# Altium schematic sheet STM32F103VET6_Board.SchDoc
size A1
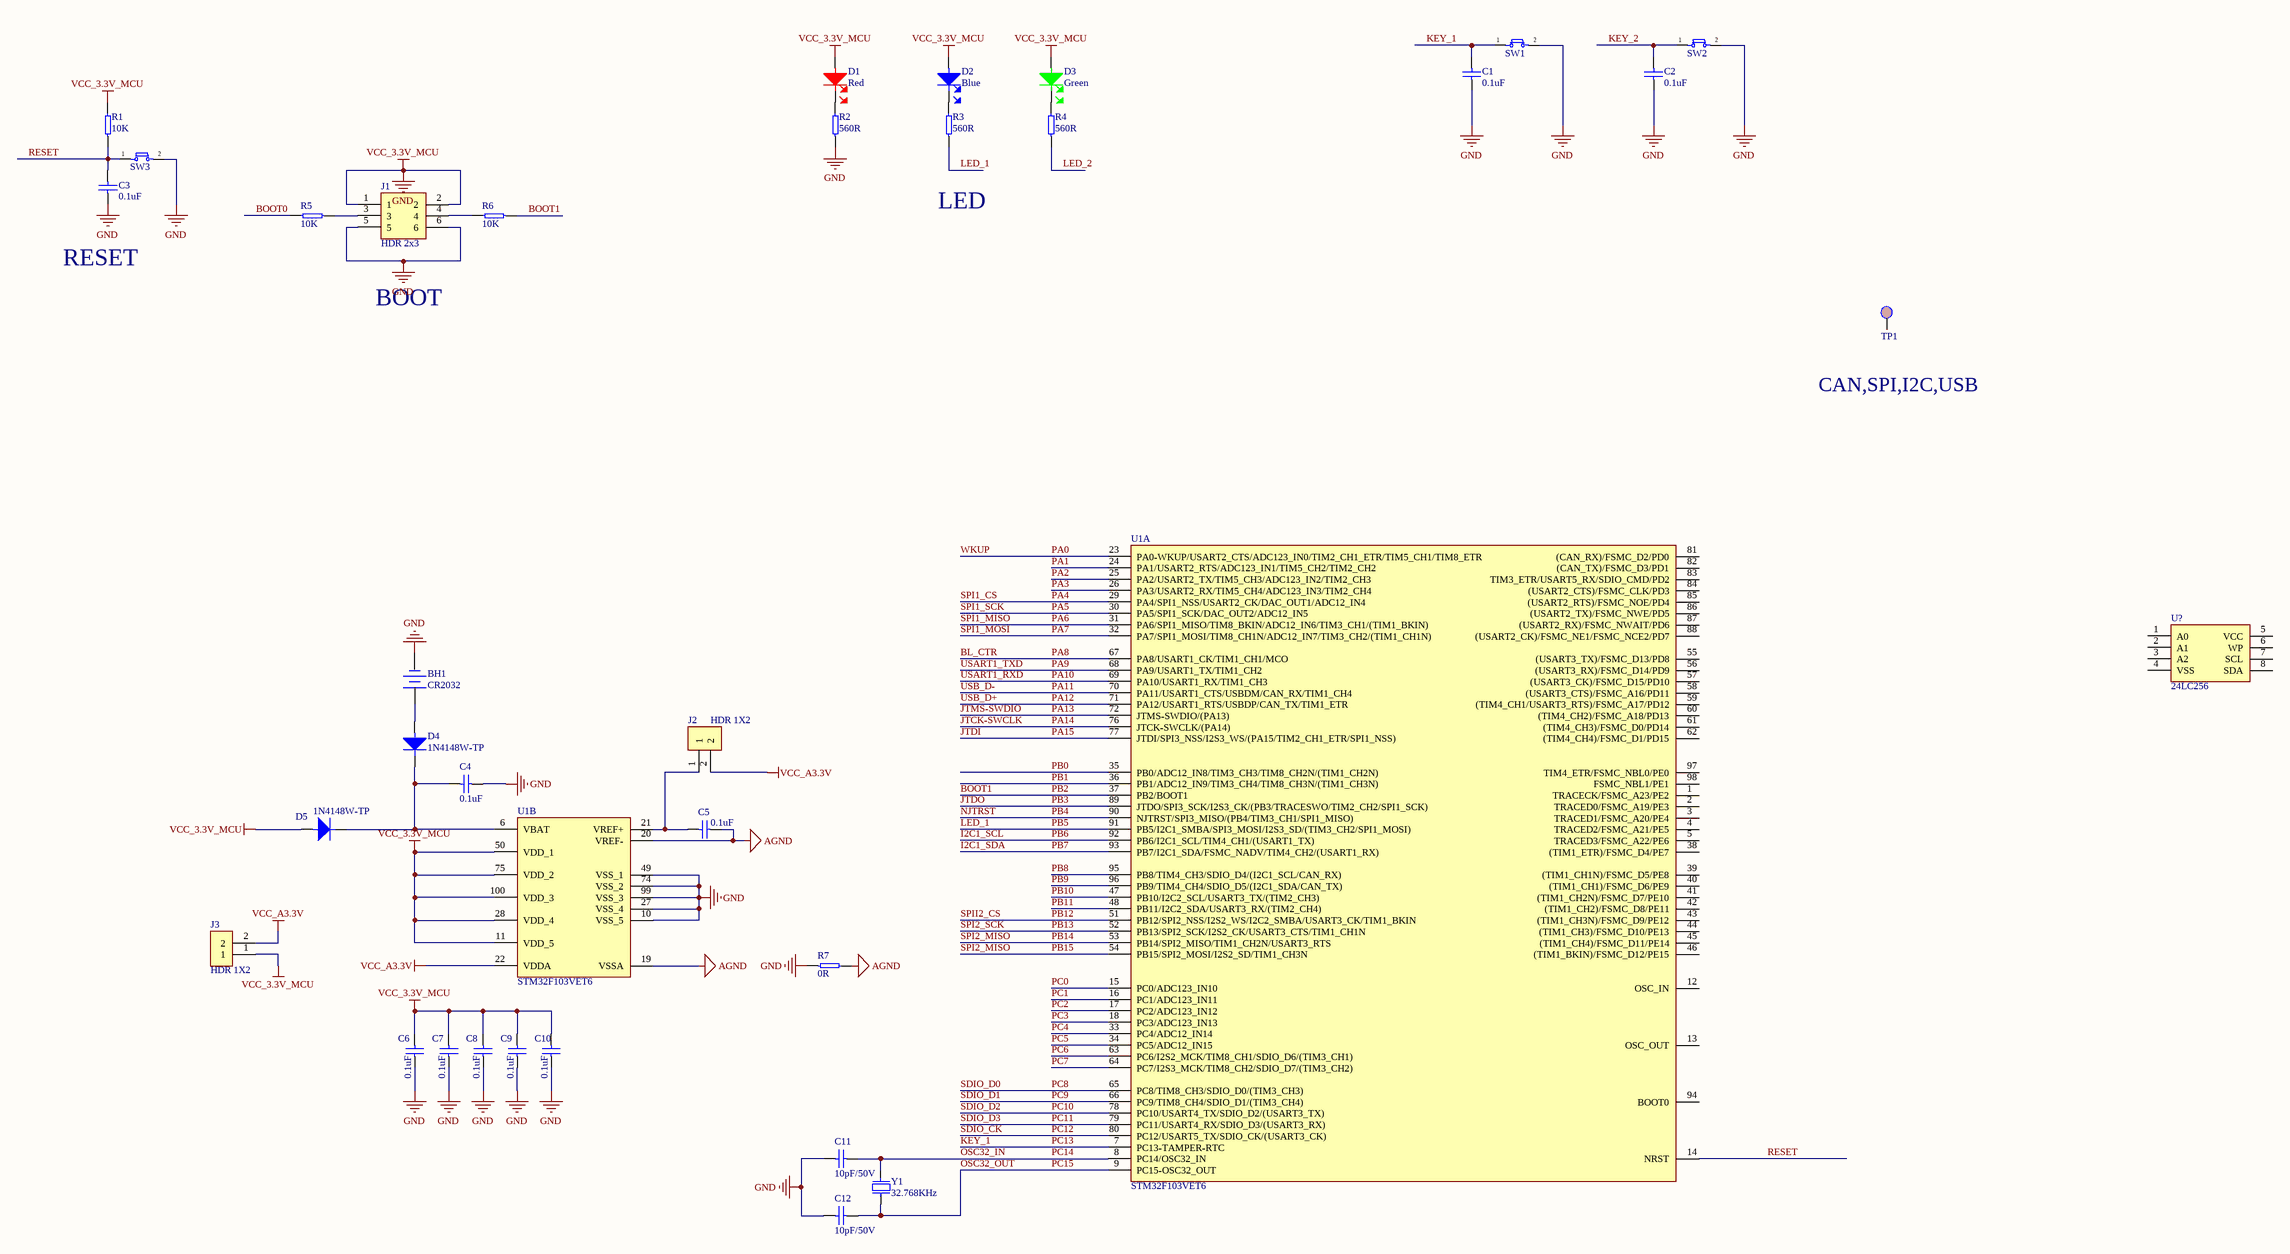
[diagram p0: STM32F103VET6_Board.SchDoc]

## Parts
BH1  CR2032  [BATTERRY_HOLDER_CR2032]
C1  0.1uF  [C0805]
C2  0.1uF  [C0805]
C3  0.1uF  [C0805]
C4  0.1uF  [C0603]
C5  0.1uF  [C0603]
C6  0.1uF  [C0603]
C7  0.1uF  [C0603]
C8  0.1uF  [C0603]
C9  0.1uF  [C0603]
C10  0.1uF  [C0603]
C11  10pF/50V  [C0805]
C12  10pF/50V  [C0805]
D1  Red  [LED_RED_0805]
D2  Blue  [LED_BLUE_0805]
D3  Green  [LED_GREEN_0805]
D4  1N4148W-TP  [SOD_123]
D5  1N4148W-TP  [SOD_123]
J1  HDR 2x3  [HDR_2X3_2.54MM]
J2  HDR 1X2  [HDR_1X2_2.54MM]
J3  HDR 1X2  [HDR_1X2_2.54MM]
R1  10K  [R0603]
R2  560R  [R0805]
R3  560R  [R0805]
R4  560R  [R0805]
R5  10K  [R0603]
R6  10K  [R0603]
R7  0R  [R0805]
SW1  1825910-6  [BUTTON_4P_DIP]  (value not drawn)
SW2  1825910-6  [BUTTON_4P_DIP]  (value not drawn)
SW3  1825910-6  [BUTTON_4P_DIP]  (value not drawn)
TP1  Test point 0.6x1.2  [TESTPOINT 0.6X1.2]  (value not drawn)
U1  STM32F103VET6  [LQFP100]  (parts A,B of 2)
U?  24LC256  [SOIC8]
Y1  32.768KHz  [CRY_32.768]

## Nets
AGND: C5.2 R7.2 U1.19(VSSA) U1.20(VREF-)
GND: BH1.1(N) C1.1 C2.1 C3.1 C4.2 C6.1 C6.2 C7.1 C7.2 C8.1 C8.2 C9.1 C9.2 C10.1 C10.2 C11.1 C12.1 D1.1(Anode) D2.1(Anode) D3.1(Anode) D5.1(Anode) J1.1 J1.2 J1.5 J1.6 J3.1 R1.2 R2.1 R7.1 SW1.2 SW2.2 SW3.2 U1.10(VSS_5) U1.11(VDD_5) U1.27(VSS_4) U1.28(VDD_4) U1.49(VSS_1) U1.50(VDD_1) U1.74(VSS_2) U1.75(VDD_2) U1.99(VSS_3) U1.100(VDD_3)  [also labelled VCC_3.3V_MCU]
VCC_A3.3V: J2.2 J3.2 U1.22(VDDA)
BL_CTR: U1.67(PA8/USART1_CK/TIM1_CH1/MCO)  [also labelled PA8]
BOOT0: R5.2
BOOT1: R6.1 U1.37(PB2/BOOT1)  [also labelled PB2]
I2C1_SCL: U1.92(PB6/I2C1_SCL/TIM4_CH1/(USART1_TX))  [also labelled PB6]
I2C1_SDA: U1.93(PB7/I2C1_SDA/FSMC_NADV/TIM4_CH2/(USART1_RX))  [also labelled PB7]
JTCK-SWCLK: U1.76(JTCK-SWCLK/(PA14))  [also labelled PA14]
JTDI: U1.77(JTDI/SPI3_NSS/I2S3_WS/(PA15/TIM2_CH1_ETR/SPI1_NSS))  [also labelled PA15]
JTDO: U1.89(JTDO/SPI3_SCK/I2S3_CK/(PB3/TRACESWO/TIM2_CH2/SPI1_SCK))  [also labelled PB3]
JTMS-SWDIO: U1.72(JTMS-SWDIO/(PA13))  [also labelled PA13]
KEY_1: C1.2 SW1.1 U1.7(PC13-TAMPER-RTC)  [also labelled PC13]
KEY_2: C2.2 SW2.1
LED_1: R3.1 U1.91(PB5/I2C1_SMBA/SPI3_MOSI/I2S3_SD/(TIM3_CH2/SPI1_MOSI))  [also labelled PB5]
LED_2: R4.1
NJTRST: U1.90(NJTRST/SPI3_MISO/(PB4/TIM3_CH1/SPI1_MISO))  [also labelled PB4]
OSC32_IN: C11.2 U1.8(PC14/OSC32_IN) Y1.2  [also labelled PC14]
OSC32_OUT: C12.2 U1.9(PC15-OSC32_OUT) Y1.1  [also labelled PC15]
PA0: U1.23(PA0-WKUP/USART2_CTS/ADC123_IN0/TIM2_CH1_ETR/TIM5_CH1/TIM8_ETR)  [also labelled WKUP]
PA1: U1.24(PA1/USART2_RTS/ADC123_IN1/TIM5_CH2/TIM2_CH2)
PA2: U1.25(PA2/USART2_TX/TIM5_CH3/ADC123_IN2/TIM2_CH3)
PA3: U1.26(PA3/USART2_RX/TIM5_CH4/ADC123_IN3/TIM2_CH4)
PA4: U1.29(PA4/SPI1_NSS/USART2_CK/DAC_OUT1/ADC12_IN4)  [also labelled SPI1_CS]
PA5: U1.30(PA5/SPI1_SCK/DAC_OUT2/ADC12_IN5)  [also labelled SPI1_SCK]
PA6: U1.31(PA6/SPI1_MISO/TIM8_BKIN/ADC12_IN6/TIM3_CH1/(TIM1_BKIN))  [also labelled SPI1_MISO]
PA7: U1.32(PA7/SPI1_MOSI/TIM8_CH1N/ADC12_IN7/TIM3_CH2/(TIM1_CH1N))  [also labelled SPI1_MOSI]
PA9: U1.68(PA9/USART1_TX/TIM1_CH2)  [also labelled USART1_TXD]
PA10: U1.69(PA10/USART1_RX/TIM1_CH3)  [also labelled USART1_RXD]
PA11: U1.70(PA11/USART1_CTS/USBDM/CAN_RX/TIM1_CH4)  [also labelled USB_D-]
PA12: U1.71(PA12/USART1_RTS/USBDP/CAN_TX/TIM1_ETR)  [also labelled USB_D+]
PB0: U1.35(PB0/ADC12_IN8/TIM3_CH3/TIM8_CH2N/(TIM1_CH2N))
PB1: U1.36(PB1/ADC12_IN9/TIM3_CH4/TIM8_CH3N/(TIM1_CH3N))
PB8: U1.95(PB8/TIM4_CH3/SDIO_D4/(I2C1_SCL/CAN_RX))
PB9: U1.96(PB9/TIM4_CH4/SDIO_D5/(I2C1_SDA/CAN_TX))
PB10: U1.47(PB10/I2C2_SCL/USART3_TX/(TIM2_CH3))
PB11: U1.48(PB11/I2C2_SDA/USART3_RX/(TIM2_CH4))
PB12: U1.51(PB12/SPI2_NSS/I2S2_WS/I2C2_SMBA/USART3_CK/TIM1_BKIN)  [also labelled SPII2_CS]
PB13: U1.52(PB13/SPI2_SCK/I2S2_CK/USART3_CTS/TIM1_CH1N)  [also labelled SPI2_SCK]
PB14: U1.53(PB14/SPI2_MISO/TIM1_CH2N/USART3_RTS) U1.54(PB15/SPI2_MOSI/I2S2_SD/TIM1_CH3N)  [also labelled PB15, SPI2_MISO]
PC0: U1.15(PC0/ADC123_IN10)
PC1: U1.16(PC1/ADC123_IN11)
PC2: U1.17(PC2/ADC123_IN12)
PC3: U1.18(PC3/ADC123_IN13)
PC4: U1.33(PC4/ADC12_IN14)
PC5: U1.34(PC5/ADC12_IN15)
PC6: U1.63(PC6/I2S2_MCK/TIM8_CH1/SDIO_D6/(TIM3_CH1))
PC7: U1.64(PC7/I2S3_MCK/TIM8_CH2/SDIO_D7/(TIM3_CH2))
PC8: U1.65(PC8/TIM8_CH3/SDIO_D0/(TIM3_CH3))  [also labelled SDIO_D0]
PC9: U1.66(PC9/TIM8_CH4/SDIO_D1/(TIM3_CH4))  [also labelled SDIO_D1]
PC10: U1.78(PC10/USART4_TX/SDIO_D2/(USART3_TX))  [also labelled SDIO_D2]
PC11: U1.79(PC11/USART4_RX/SDIO_D3/(USART3_RX))  [also labelled SDIO_D3]
PC12: U1.80(PC12/USART5_TX/SDIO_CK/(USART3_CK))  [also labelled SDIO_CK]
RESET: C3.2 R1.1 SW3.1 U1.14(NRST)
NetBH1_2: BH1.2(P) D4.1(Anode)
NetC4_1: C4.1 D4.2(Cathode) D5.2(Cathode) U1.6(VBAT)
NetC5_1: C5.1 J2.1 U1.21(VREF+)
NetD1_2: D1.2(Cathode) R2.2
NetD2_2: D2.2(Cathode) R3.2
NetD3_2: D3.2(Cathode) R4.2
NetJ1_3: J1.3 R5.1
NetJ1_4: J1.4 R6.2

Not connected (* = marked no-connect by the designer): TP1 1; U1 1(TRACECK/FSMC_A23/PE2) 2(TRACED0/FSMC_A19/PE3) 3(TRACED1/FSMC_A20/PE4) 4(TRACED2/FSMC_A21/PE5) 5(TRACED3/FSMC_A22/PE6) 12(OSC_IN) 13(OSC_OUT) 38((TIM1_ETR)/FSMC_D4/PE7) 39((TIM1_CH1N)/FSMC_D5/PE8) 40((TIM1_CH1)/FSMC_D6/PE9) 41((TIM1_CH2N)/FSMC_D7/PE10) 42((TIM1_CH2)/FSMC_D8/PE11) 43((TIM1_CH3N)/FSMC_D9/PE12) 44((TIM1_CH3)/FSMC_D10/PE13) 45((TIM1_CH4)/FSMC_D11/PE14) 46((TIM1_BKIN)/FSMC_D12/PE15) 55((USART3_TX)/FSMC_D13/PD8) 56((USART3_RX)/FSMC_D14/PD9) 57((USART3_CK)/FSMC_D15/PD10) 58((USART3_CTS)/FSMC_A16/PD11) 59((TIM4_CH1/USART3_RTS)/FSMC_A17/PD12) 60((TIM4_CH2)/FSMC_A18/PD13) 61((TIM4_CH3)/FSMC_D0/PD14) 62((TIM4_CH4)/FSMC_D1/PD15) 81((CAN_RX)/FSMC_D2/PD0) 82((CAN_TX)/FSMC_D3/PD1) 83(TIM3_ETR/USART5_RX/SDIO_CMD/PD2) 84((USART2_CTS)/FSMC_CLK/PD3) 85((USART2_RTS)/FSMC_NOE/PD4) 86((USART2_TX)/FSMC_NWE/PD5) 87((USART2_RX)/FSMC_NWAIT/PD6) 88((USART2_CK)/FSMC_NE1/FSMC_NCE2/PD7) 94(BOOT0) 97(TIM4_ETR/FSMC_NBL0/PE0) 98(FSMC_NBL1/PE1); U? 1(A0) 2(A1) 3(A2) 4(VSS) 5(VCC) 6(WP) 7(SCL) 8(SDA)

## Notes on the sheet
- LED
- RESET
- BOOT
- CAN,SPI,I2C,USB

## Library data of the parts
BH1 = BATTERRY_HOLDER_CR2032: Manufacturer: Memory Protection Devices; Manufacturer Part Number: BH-18650-PC; Number of Cells: 1; Supplier 1: Digi-Key; Supplier Part Number 1: BH-18650-PC-ND; Stock 1: 5780; Pricing 1: 1 = 3.79000, 10 = 3.18700, 100 = 2.63470, 500 = 2.27082, 1000 = 2.12027 (USD); RoHS: Yes; Mount: Through Hole,PCB; Min Operating Temperature: -40°C; Max Operating Temperature: 180°C; Package Quantity: 100; Termination: PC Pin; ComponentLink1URL: https://datasheet.ciiva.com/3/bh-18650-pc-datasheet-3874.pdf?src-supplier=Digi-Key; ComponentLink1Description: https://datasheet.ciiva.com/3/bh-18650-pc-datasheet-3874.pdf?src-supplier=Digi-Key
C1-C3 = C0.1uF_0805: KEMET         C0805C104Z5VACTU.             CERAMIC CAPACITOR, 0.1UF, 50V, Y5V, +80,-20%, 0805; Capacitance: 100nF; Tolerance: 80%; Dissipation Factor: 5%; Supplier 1: Digi-Key; Manufacturer: KEMET; Manufacturer Part Number: C0805C104Z5VACTU; Stock 1: 1249727; Pricing 1: 1 = 0.10000, 10 = 0.05700, 100 = 0.02540, 500 = 0.01818, 1000 = 0.01428 (USD); RoHS: Yes; Mount: Surface Mount,PCB; Case/Package: 0805; Number of Pins: 2; Case Code (Metric): 2012; Case Code (Imperial): 0805; Dielectric Material: Ceramic; Min Operating Temperature: -30°C; Max Operating Temperature: 85°C; Package Quantity: 1; Voltage Rating: 50V; Packaging: Tape and Reel; Voltage Rating (DC): 50V; Dielectric: Y5V; Termination: SMD/SMT; Voltage: 50V; Length: 2mm; Height: 0.9mm; Width: 0.049inch; Thickness: 0.039inch; Lead Pitch: 0.75mm; Depth: 1.25mm; Radiation Hardening: No; REACH SVHC: No SVHC; Lead Free: Lead Free; ComponentLink1URL: https://datasheet.ciiva.com/14597/70095383-14597846.pdf?src-supplier=Allied+Electronics; ComponentLink1Description: https://datasheet.ciiva.com/14597/70095383-14597846.pdf?src-supplier=Allied+Electronics; ComponentLink2URL: https://datasheet.ciiva.com/18219/getdatasheetpartid-37101-18219255.pdf?src-supplier=Verical; ComponentLink2Description: https://datasheet.ciiva.com/18219/getdatasheetpartid-37101-18219255.pdf?src-supplier=Verical; ComponentLink3URL: https://datasheet.ciiva.com/26847/getdatasheetpartid-321176-26847799.pdf?src-supplier=Verical; ComponentLink3Description: https://datasheet.ciiva.com/26847/getdatasheetpartid-321176-26847799.pdf?src-supplier=Verical; ComponentLink4URL: https://datasheet.ciiva.com/14608/70095383-14608251.pdf?src-supplier=Allied+Electronics; ComponentLink4Description: https://datasheet.ciiva.com/14608/70095383-14608251.pdf?src-supplier=Allied+Electronics; ComponentLink5URL: https://datasheet.ciiva.com/7842/1470417-7842543.pdf?src-supplier=Element14; ComponentLink5Description: https://datasheet.ciiva.com/7842/1470417-7842543.pdf?src-supplier=Element14; Supplier Part Number 1: 399-1177-1-ND
C4-C10 = C0.1uF_0603
C11 C12 = C10pF_0805
D1 = LED_RED_0805: LED RED DIFFUSED 0805 SMD; Manufacturer: Osram Opto; Manufacturer Part Number: LHR974-LP-1; Forward Voltage: 2.6V; Lens Style: Diffused,Colorless; Luminous Intensity: 15mcd; Viewing Angle: 160°; Forward Current: 30mA; Dominant Wavelength: 645nm; Number of Elements: 1; Test Current: 20mA; Reverse Voltage: 5V; Supplier 1: Digi-Key; Supplier Part Number 1: 475-1415-1-ND; Stock 1: 73137; Pricing 1: 1 = 0.27000, 10 = 0.20100, 100 = 0.09510, 500 = 0.06340, 1000 = 0.04966 (USD); RoHS: Yes; Mount: Surface Mount; Number of Pins: 2; Min Operating Temperature: -30°C; Max Operating Temperature: 85°C; Packaging: Tape and Reel; Length: 2.1mm; Depth: 1.35mm; Radiation Hardening: No; ComponentLink1URL: http://www.jameco.com/Jameco/Products/ProdDS/2085634.pdf?src-supplier=Jameco; ComponentLink1Description: http://www.jameco.com/Jameco/Products/ProdDS/2085634.pdf?src-supplier=Jameco; ComponentLink2URL: http://components.arrow.com/part/dataview/0323_01825492?src-supplier=Arrow+Europe; ComponentLink2Description: http://components.arrow.com/part/dataview/0323_01825492?src-supplier=Arrow+Europe; ComponentLink3URL: http://components.arrow.com/part/dataview/41971690S1077610N9133?src-supplier=Arrow; ComponentLink3Description: http://components.arrow.com/part/dataview/41971690S1077610N9133?src-supplier=Arrow; ComponentLink4URL: https://dammedia.osram.info/media/resource/hires/osram-dam-2493888/LH%20R974.pdf?src-supplier=Digi-Key; ComponentLink4Description: https://dammedia.osram.info/media/resource/hires/osram-dam-2493888/LH%20R974.pdf?src-supplier=Digi-Key; ComponentLink5URL: http://components.arrow.com/part/dataview/41971690S6190115N2128?src-supplier=Arrow; ComponentLink5Description: http://components.arrow.com/part/dataview/41971690S6190115N2128?src-supplier=Arrow; ComponentLink6URL: http://www.mouser.com/ds/2/311/LH%20R974%20-%20CHIPLED%200805-318659.pdf?src-supplier=Mouser; ComponentLink6Description: http://www.mouser.com/ds/2/311/LH%20R974%20-%20CHIPLED%200805-318659.pdf?src-supplier=Mouser; ComponentLink7URL: https://www.verical.com/server-webapp/html/getDatasheet?partID=258950&src-supplier=Verical; ComponentLink7Description: https://www.verical.com/server-webapp/html/getDatasheet?partID=258950&src-supplier=Verical
D2 = LED_BLUE_0805: LED BLUE DIFFUSED 0805 SMD; Manufacturer: Osram Opto; Manufacturer Part Number: LHR974-LP-1; Forward Voltage: 2.6V; Lens Style: Diffused,Colorless; Luminous Intensity: 15mcd; Viewing Angle: 160°; Forward Current: 30mA; Dominant Wavelength: 645nm; Number of Elements: 1; Test Current: 20mA; Reverse Voltage: 5V; Supplier 1: Digi-Key; Supplier Part Number 1: 475-1415-1-ND; Stock 1: 73137; Pricing 1: 1 = 0.27000, 10 = 0.20100, 100 = 0.09510, 500 = 0.06340, 1000 = 0.04966 (USD); RoHS: Yes; Mount: Surface Mount; Number of Pins: 2; Min Operating Temperature: -30°C; Max Operating Temperature: 85°C; Packaging: Tape and Reel; Length: 2.1mm; Depth: 1.35mm; Radiation Hardening: No
D3 = LED_GREEN_0805: LED GREEN DIFFUSED 0805 SMD; Manufacturer: Vishay Lite-On; Manufacturer Part Number: LTST-C171GKT; Lens Color: Colorless; Viewing Angle: 130°; Lens Style: Diffused,Colorless,Rectangular,Clear; Luminous Intensity: 12mcd; Forward Current: 30mA; Forward Voltage: 2.1V; Power Rating: 100mW; Dominant Wavelength: 569nm; Test Current: 10mA; Lens Transparency: Clear; Number of Elements: 1; Wavelength: 585nm; Reverse Voltage: 5V; Supplier 1: Digi-Key; Supplier Part Number 1: 160-1423-1-ND; Stock 1: 284618; Pricing 1: 1 = 0.28000, 10 = 0.20100, 100 = 0.09540, 500 = 0.06364, 1000 = 0.04984 (USD); RoHS: Yes; Mount: Surface Mount; Case/Package: 0805; Number of Pins: 2; Color: Green; Case Code (Metric): 2012; Case Code (Imperial): 0805; Min Operating Temperature: -55°C; Max Operating Temperature: 85°C; Package Quantity: 1; Packaging: Tape and Reel; Illumination Color: Green; Power Dissipation: 100mW; Number of LEDs: 1; Length: 2mm; Height: 0.8mm; Width: 1.25mm; Depth: 1.25mm; Radiation Hardening: No; Lead Free: Lead Free; ComponentLink1URL: https://datasheet.ciiva.com/11773/0900766b80dc0296-11773991.pdf?src-supplier=RSComponents; ComponentLink1Description: https://datasheet.ciiva.com/11773/0900766b80dc0296-11773991.pdf?src-supplier=RSComponents; ComponentLink2URL: https://datasheet.ciiva.com/2110/ltst-c171gkt-2110000.pdf?src-supplier=Digi-Key; ComponentLink2Description: https://datasheet.ciiva.com/2110/ltst-c171gkt-2110000.pdf?src-supplier=Digi-Key; ComponentLink3URL: https://datasheet.ciiva.com/12400/lite-on-ltst-c171gkt-190133-12400647.pdf?src-supplier=Mouser; ComponentLink3Description: https://datasheet.ciiva.com/12400/lite-on-ltst-c171gkt-190133-12400647.pdf?src-supplier=Mouser; ComponentLink4URL: https://datasheet.ciiva.com/2110/ltst-c171gkt-2110001.pdf?src-supplier=Digi-Key; ComponentLink4Description: https://datasheet.ciiva.com/2110/ltst-c171gkt-2110001.pdf?src-supplier=Digi-Key; ComponentLink5URL: https://datasheet.ciiva.com/2110/ltst-c171gkt-2110002.pdf?src-supplier=Digi-Key; ComponentLink5Description: https://datasheet.ciiva.com/2110/ltst-c171gkt-2110002.pdf?src-supplier=Digi-Key; ComponentLink6URL: https://datasheet.ciiva.com/16396/ltst-c171gkt-16396549.pdf?src-supplier=Future+Electronics; ComponentLink6Description: https://datasheet.ciiva.com/16396/ltst-c171gkt-16396549.pdf?src-supplier=Future+Electronics
D4 D5 = 1N4148: DIODE GEN PURP 100V 150MA SOD123; Manufacturer: MCC; Max Surge Current: 2A; Forward Voltage: 1V; Recovery Time: 4ns; Max Reverse Leakage Current: 5uA; Power Dissipation: 400mW; Max Forward Surge Current (Ifsm): 1A; Element Configuration: Single; Polarity: Standard; Capacitance: 4pF; Supplier 1: Digi-Key; Supplier Part Number 1: 1N4148WTPMSCT-ND; Manufacturer Part Number: 1N4148W-TP; Stock 1: 463995; Pricing 1: 1 = 0.10000, 10 = 0.08100, 100 = 0.03400, 500 = 0.02670, 1000 = 0.01854 (USD); RoHS: Yes; Mount: Surface Mount; Number of Pins: 2; Min Operating Temperature: -65°C; Max Operating Temperature: 150°C; Packaging: Tape and Reel; Forward Current: 150mA; Package Quantity: 3000; Average Rectified Current: 150mA; Reverse Recovery Time: 4ns; Max Repetitive Reverse Voltage (Vrrm): 100V; Peak Non-Repetitive Surge Current: 2A; Voltage Rating (DC): 100V; Current Rating: 150mA; Output Current: 150mA; Max Reverse Voltage (DC): 100V; Length: 2.85mm; Height: 1.2mm; Width: 1.8mm; Radiation Hardening: No; REACH SVHC: Unknown; Lead Free: Lead Free; ComponentLink1URL: https://datasheet.ciiva.com/1243/1684829-1243908.pdf?src-supplier=Newark; ComponentLink1Description: https://datasheet.ciiva.com/1243/1684829-1243908.pdf?src-supplier=Newark; ComponentLink2URL: https://datasheet.ciiva.com/4435/1n4148wsod123-48460-4435223.pdf?src-supplier=Mouser; ComponentLink2Description: https://datasheet.ciiva.com/4435/1n4148wsod123-48460-4435223.pdf?src-supplier=Mouser; ComponentLink3URL: https://datasheet.ciiva.com/16836/1n4148wsod123-16836277.pdf?src-supplier=Future+Electronics; ComponentLink3Description: https://datasheet.ciiva.com/16836/1n4148wsod123-16836277.pdf?src-supplier=Future+Electronics; ComponentLink4URL: https://datasheet.ciiva.com/911/1n4148wsod123-911676.pdf?src-supplier=Digi-Key; ComponentLink4Description: https://datasheet.ciiva.com/911/1n4148wsod123-911676.pdf?src-supplier=Digi-Key; ComponentLink5URL: https://datasheet.ciiva.com/7622/1684829-7622556.pdf?src-supplier=Element14; ComponentLink5Description: https://datasheet.ciiva.com/7622/1684829-7622556.pdf?src-supplier=Element14; ComponentLink6URL: https://datasheet.ciiva.com/22747/1684829-22747439.pdf?src-supplier=Element14; ComponentLink6Description: https://datasheet.ciiva.com/22747/1684829-22747439.pdf?src-supplier=Element14; ComponentLink7URL: https://datasheet.ciiva.com/14557/70055519-14557767.pdf?src-supplier=Allied+Electronics; ComponentLink7Description: https://datasheet.ciiva.com/14557/70055519-14557767.pdf?src-supplier=Allied+Electronics; ComponentLink8URL: https://datasheet.ciiva.com/911/1n4148wsod123-911677.pdf?src-supplier=Digi-Key; ComponentLink8Description: https://datasheet.ciiva.com/911/1n4148wsod123-911677.pdf?src-supplier=Digi-Key; ComponentLink9URL: https://datasheet.ciiva.com/911/1n4148wsod123-911678.pdf?src-supplier=Digi-Key; ComponentLink9Description: https://datasheet.ciiva.com/911/1n4148wsod123-911678.pdf?src-supplier=Digi-Key
J1 = HDR_2x3_2.54mm: CONN HEADER VERT 6POS 2.54MM; Manufacturer: Amphenol FCI; Manufacturer Part Number: 67997-106HLF; Number of Contacts: 6; Current Rating: 3A; Voltage Rating: 1.5kV; Insulation Resistance: 5GR; Gender: Male; Connector Type: Male Pin; Row Spacing: 0.1inch; Contact Post Length: 3.05mm; Supplier 1: Digi-Key; Supplier Part Number 1: 609-3393-ND; Stock 1: 104; Pricing 1: 1 = 1.78000, 10 = 1.61400, 100 = 1.38370, 500 = 1.15308, 1000 = 0.98835, 5000 = 0.87634, 10000 = 0.85657 (USD); RoHS: Yes; Mount: Through Hole; Contact Plating: Gold,GXT; Contact Material: Bronze; Color: Black; Housing Color: Black; Housing Material: Thermoplastic; Min Operating Temperature: -65°C; Max Operating Temperature: 125°C; Number of Rows: 2; Termination: Through Hole; Packaging: Bulk; Package Quantity: 100; Contact Gender: Male; Number of Positions: 6; Max Voltage Rating (AC): 1.5kV; Orientation: Straight; Length: 7.62mm; Pitch: 2.54mm; Contact Mating Length: 0.23inch; Depth: 4.83mm; Radiation Hardening: No; REACH SVHC: No SVHC; Lead Free: Lead Free; Flammability Rating: UL94 V-0; ComponentLink1URL: https://datasheet.ciiva.com/5153/67996-222463-5153820.pdf?src-supplier=Mouser; ComponentLink1Description: https://datasheet.ciiva.com/5153/67996-222463-5153820.pdf?src-supplier=Mouser; ComponentLink2URL: https://datasheet.ciiva.com/10149/67996-10149221.pdf?src-supplier=Avnet; ComponentLink2Description: https://datasheet.ciiva.com/10149/67996-10149221.pdf?src-supplier=Avnet; ComponentLink3URL: https://datasheet.ciiva.com/46393/1876884-46393067.pdf?src-supplier=Element14; ComponentLink3Description: https://datasheet.ciiva.com/46393/1876884-46393067.pdf?src-supplier=Element14; ComponentLink4URL: https://datasheet.ciiva.com/722/67996-722044.pdf?src-supplier=Digi-Key; ComponentLink4Description: https://datasheet.ciiva.com/722/67996-722044.pdf?src-supplier=Digi-Key; ComponentLink5URL: https://datasheet.ciiva.com/16726/67996-16726286.pdf?src-supplier=Avnet+Europe; ComponentLink5Description: https://datasheet.ciiva.com/16726/67996-16726286.pdf?src-supplier=Avnet+Europe
J2 J3 = HDR_1x2_2.54mm: CONN HEADER VERT 2POS 2.54MM; Manufacturer: Amphenol FCI; Manufacturer Part Number: 68001-402HLF; Number of Contacts: 2; Current Rating: 3A; Voltage Rating: 1.5kV; Insulation Resistance: 5GR; Gender: Male; Connector Type: Male Pin; Contact Post Length: 3.05mm; Supplier 1: Digi-Key; Supplier Part Number 1: 609-3507-ND; Stock 1: 13583; Pricing 1: 1 = 0.12000, 10 = 0.11600, 100 = 0.07160, 500 = 0.05928, 1000 = 0.05187, 5000 = 0.04446, 10000 = 0.04323 (USD); RoHS: Yes; Mount: Through Hole; Contact Plating: Tin; Color: Black; Contact Material: Bronze; Housing Color: Black; Housing Material: Thermoplastic; Min Operating Temperature: -65°C; Max Operating Temperature: 125°C; Number of Rows: 1; Termination: Solder; Package Quantity: 100; Packaging: Bulk; Contact Gender: Male; Number of Positions: 2; Max Voltage Rating (AC): 1.5kV; Orientation: Straight; Length: 5.08mm; Pitch: 2.54mm; Contact Mating Length: 0.23inch; Depth: 2.41mm; Radiation Hardening: No; REACH SVHC: No SVHC; Lead Free: Lead Free; Flammability Rating: UL94 V-0; ComponentLink1URL: https://datasheet.ciiva.com/724/68000-724389.pdf?src-supplier=Digi-Key; ComponentLink1Description: https://datasheet.ciiva.com/724/68000-724389.pdf?src-supplier=Digi-Key; ComponentLink2URL: https://datasheet.ciiva.com/16726/68000-16726185.pdf?src-supplier=Avnet+Europe; ComponentLink2Description: https://datasheet.ciiva.com/16726/68000-16726185.pdf?src-supplier=Avnet+Europe; ComponentLink3URL: https://datasheet.ciiva.com/10149/68000-10149338.pdf?src-supplier=Avnet; ComponentLink3Description: https://datasheet.ciiva.com/10149/68000-10149338.pdf?src-supplier=Avnet; ComponentLink4URL: https://datasheet.ciiva.com/46385/1748756-46385306.pdf?src-supplier=Element14; ComponentLink4Description: https://datasheet.ciiva.com/46385/1748756-46385306.pdf?src-supplier=Element14
R1 R5 R6 = R10K_0603: RES SMD 10K OHM 1% 1/8W 0603; Manufacturer: Yageo; Manufacturer Part Number: RC0805FR-0710KL; Resistance: 10kR; Temperature Coefficient: 100ppm/°C; Power Rating: 125mW; Voltage Rating: 150V; Supplier 1: Digi-Key; Supplier Part Number 1: 311-10.0KCRCT-ND; Stock 1: 37831014; Pricing 1: 1 = 0.10000, 10 = 0.03600, 100 = 0.01450, 1000 = 0.00652, 2500 = 0.00566 (USD); RoHS: Yes; Case/Package: 0805; Case Code (Imperial): 0805; Case Code (Metric): 2012; Min Operating Temperature: -55°C; Max Operating Temperature: 155°C; Tolerance: 1%; Composition: Thick Film; Packaging: Tape and Reel; Package Quantity: 1; Termination: SMD/SMT; Number of Terminations: 2; Military Standard: Not; Max Power Dissipation: 125mW; Features: Moisture Resistant; Length: 2mm; Height: 0.024inch; Width: 0.049inch; Depth: 1.25mm; REACH SVHC: Unknown; Lead Free: Lead Free
R2-R4 = R560R_0805: RES SMD 560 OHM 1% 1/8W 0805; Manufacturer: Yageo; Manufacturer Part Number: RC0805FR-07560RL; Temperature Coefficient: 100ppm/°C; Power Rating: 125mW; Voltage Rating: 150V; Supplier 1: Digi-Key; Supplier Part Number 1: 311-560CRCT-ND; Stock 1: 546986; Pricing 1: 1 = 0.10000, 10 = 0.04000, 100 = 0.01630, 1000 = 0.00731, 2500 = 0.00635 (USD); RoHS: Yes; Case/Package: 0805; Weight: 0.000194oz; Case Code (Metric): 2012; Case Code (Imperial): 0805; Min Operating Temperature: -55°C; Max Operating Temperature: 155°C; Tolerance: 1%; Resistance: 560R; Composition: Thick Film; Packaging: Tape and Reel; Package Quantity: 1; Number of Terminations: 2; Termination: SMD/SMT; Military Standard: Not; Max Power Dissipation: 125mW; Features: Moisture Resistant; Length: 2mm; Height: 0.5mm; Width: 0.049inch; Depth: 1.25mm; REACH SVHC: Unknown; Lead Free: Lead Free; ComponentLink1URL: https://datasheet.ciiva.com/5561/rc0805-5561861.pdf?src-supplier=Mouser; ComponentLink1Description: https://datasheet.ciiva.com/5561/rc0805-5561861.pdf?src-supplier=Mouser; ComponentLink2URL: https://datasheet.ciiva.com/2457/pyu-r-int-thick-7-2457142.pdf?src-supplier=Digi-Key; ComponentLink2Description: https://datasheet.ciiva.com/2457/pyu-r-int-thick-7-2457142.pdf?src-supplier=Digi-Key; ComponentLink3URL: https://datasheet.ciiva.com/2457/pyu-r-int-thick-7-2457140.pdf?src-supplier=Digi-Key; ComponentLink3Description: https://datasheet.ciiva.com/2457/pyu-r-int-thick-7-2457140.pdf?src-supplier=Digi-Key; ComponentLink4URL: https://datasheet.ciiva.com/2457/pyu-r-int-thick-7-2457141.pdf?src-supplier=Digi-Key; ComponentLink4Description: https://datasheet.ciiva.com/2457/pyu-r-int-thick-7-2457141.pdf?src-supplier=Digi-Key; ComponentLink5URL: https://datasheet.ciiva.com/7941/444164-7941813.pdf?src-supplier=Element14; ComponentLink5Description: https://datasheet.ciiva.com/7941/444164-7941813.pdf?src-supplier=Element14; ComponentLink6URL: https://datasheet.ciiva.com/7941/444164-7941814.pdf?src-supplier=Element14; ComponentLink6Description: https://datasheet.ciiva.com/7941/444164-7941814.pdf?src-supplier=Element14
R7 = R0R_0805: RES SMD 0 OHM JUMPER 1/8W 0805; Manufacturer: Yageo; Manufacturer Part Number: RC0805JR-070RL; Resistance: 0mR; Tolerance: 5%; Power Rating: 125mW; Voltage Rating: 150V; Temperature Coefficient: 200ppm/°C; Supplier 1: Digi-Key; Supplier Part Number 1: 311-0.0ARCT-ND; Stock 1: 13851015; Pricing 1: 1 = 0.10000, 10 = 0.03800, 25 = 0.02760, 50 = 0.02100, 100 = 0.01540, 250 = 0.01180, 500 = 0.00942, 1000 = 0.00694 (USD); RoHS: Yes; Case/Package: 0805; Number of Pins: 2; Contact Plating: Tin,Matte; Case Code (Imperial): 0805; Case Code (Metric): 2012; Min Operating Temperature: -55°C; Max Operating Temperature: 155°C; Composition: Thick Film; Packaging: Tape and Reel; Voltage Rating (DC): 150V; Termination: SMD/SMT; Military Standard: Not; Length: 2mm; Height: 0.5mm; Width: 1.25mm; Depth: 1.25mm; Radiation Hardening: No; REACH SVHC: Unknown; Lead Free: Lead Free; ComponentLink1URL: https://datasheet.ciiva.com/7941/1738694-7941861.pdf?src-supplier=Element14; ComponentLink1Description: https://datasheet.ciiva.com/7941/1738694-7941861.pdf?src-supplier=Element14; ComponentLink2URL: https://datasheet.ciiva.com/11819/0900766b8106beab-11819430.pdf?src-supplier=RSComponents; ComponentLink2Description: https://datasheet.ciiva.com/11819/0900766b8106beab-11819430.pdf?src-supplier=RSComponents; ComponentLink3URL: https://datasheet.ciiva.com/7941/1738694-7941862.pdf?src-supplier=Element14; ComponentLink3Description: https://datasheet.ciiva.com/7941/1738694-7941862.pdf?src-supplier=Element14; ComponentLink4URL: https://datasheet.ciiva.com/7941/1738694-7941863.pdf?src-supplier=Element14; ComponentLink4Description: https://datasheet.ciiva.com/7941/1738694-7941863.pdf?src-supplier=Element14; ComponentLink5URL: https://datasheet.ciiva.com/15190/getdatasheetpartid-330685-15190028.pdf?src-supplier=Verical; ComponentLink5Description: https://datasheet.ciiva.com/15190/getdatasheetpartid-330685-15190028.pdf?src-supplier=Verical
SW1-SW3 = BUTTON_4P_DIP: ALCOSWITCH - TE CONNECTIVITY - 1825910-6 - TACT SWITCH, SPST, 0.05A, 24VDC, SOLDER; Manufacturer: TE Connectivity Alcoswitch; Actuator Material: PBT; Mechanical Life: 100000Cycles; Operating Force: 160gf; Illumination Type: Non-Illuminated,Illuminated; Switch Travel: 0.25mm; Switch Function: Off-Mom; Actuator Type: Standard; Max Voltage Rating (DC): 24V; Contact Current Rating: 50mA; Contact Resistance: 100mR; Actuator Length: 0.055inch; Supplier 1: Digi-Key; Supplier Part Number 1: 450-1650-ND; Manufacturer Part Number: 1825910-6; Stock 1: 87641; Pricing 1: 1 = 0.10000, 10 = 0.10100, 25 = 0.09760, 50 = 0.09400, 100 = 0.08880, 250 = 0.08352, 500 = 0.08006, 1000 = 0.06091, 5000 = 0.05047 (USD); RoHS: Yes; Mount: Through Hole; Contact Material: Copper Alloy; Contact Plating: Silver; Min Operating Temperature: -35°C; Max Operating Temperature: 85°C; Termination: PC Pins; Throw Configuration: SPST; Package Quantity: 750; Packaging: Loose Piece; Orientation: Straight; Max Current Rating: 50mA; Electrical Life: 100000Cycles; Type: Switch; Length: 5.99mm; REACH SVHC: Unknown; ELV: Compliant; Lead Free: Lead Free; ComponentLink1URL: https://datasheet.ciiva.com/30199/1825910-6rqpn1825910-6-30199520.pdf?src-supplier=Onlinecomponents.com; ComponentLink1Description: https://datasheet.ciiva.com/30199/1825910-6rqpn1825910-6-30199520.pdf?src-supplier=Onlinecomponents.com; ComponentLink2URL: https://datasheet.ciiva.com/15184/getdatasheetpartid-395915-15184509.pdf?src-supplier=Verical; ComponentLink2Description: https://datasheet.ciiva.com/15184/getdatasheetpartid-395915-15184509.pdf?src-supplier=Verical
TP1 = TestPoint_0.6x1.2
U? = 24LC256/512
Y1 = CRY_32.768KHz